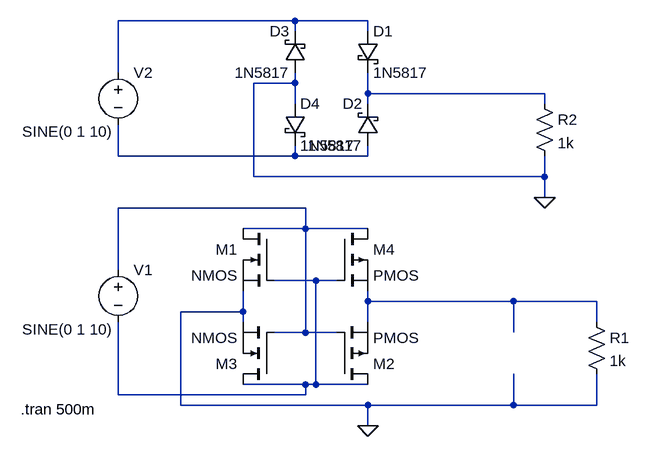
[diagram p0: schematic Gleichrichter.asc]
Gleichrichter.asc, the LTspice schematic file:
Version 4
SHEET 1 1032 680
WIRE 16 -432 -256 -432
WIRE 128 -432 16 -432
WIRE 16 -416 16 -432
WIRE 128 -416 128 -432
WIRE -256 -352 -256 -432
WIRE 16 -336 16 -352
WIRE 16 -336 -48 -336
WIRE 128 -320 128 -352
WIRE 400 -320 128 -320
WIRE 16 -304 16 -336
WIRE 128 -304 128 -320
WIRE 400 -304 400 -320
WIRE -256 -224 -256 -272
WIRE 16 -224 16 -240
WIRE 16 -224 -256 -224
WIRE 128 -224 128 -240
WIRE 128 -224 16 -224
WIRE -48 -192 -48 -336
WIRE 400 -192 400 -224
WIRE 400 -192 -48 -192
WIRE 400 -160 400 -192
WIRE 32 -144 -256 -144
WIRE 32 -112 32 -144
WIRE 32 -112 -64 -112
WIRE 128 -112 32 -112
WIRE -256 -48 -256 -144
WIRE 48 -32 -16 -32
WIRE 80 -32 48 -32
WIRE 128 0 128 -16
WIRE 352 0 128 0
WIRE 480 0 352 0
WIRE -64 16 -64 -16
WIRE -64 16 -160 16
WIRE -64 32 -64 16
WIRE 128 32 128 0
WIRE 480 32 480 0
WIRE 32 48 32 -112
WIRE 32 48 -16 48
WIRE 80 48 32 48
WIRE 352 48 352 0
WIRE 32 128 -64 128
WIRE 48 128 48 -32
WIRE 48 128 32 128
WIRE 128 128 48 128
WIRE -256 144 -256 32
WIRE 32 144 32 128
WIRE 32 144 -256 144
WIRE -160 160 -160 16
WIRE 128 160 -160 160
WIRE 352 160 352 112
WIRE 352 160 128 160
WIRE 480 160 480 112
WIRE 480 160 352 160
WIRE 128 192 128 160
FLAG 128 192 0
FLAG 400 -160 0
SYMBOL nmos -16 -112 M0
SYMATTR InstName M1
SYMBOL pmos 80 128 M180
SYMATTR InstName M2
SYMBOL voltage -256 -64 R0
WINDOW 3 -148 107 Left 2
WINDOW 123 -148 135 Left 2
WINDOW 39 0 0 Left 2
SYMATTR InstName V1
SYMATTR Value SINE(0 1 10)
SYMBOL nmos -16 128 R180
SYMATTR InstName M3
SYMBOL pmos 80 -112 R0
SYMATTR InstName M4
SYMBOL res 464 16 R0
SYMATTR InstName R1
SYMATTR Value 1k
SYMBOL voltage -256 -368 R0
WINDOW 3 -148 107 Left 2
WINDOW 123 -148 135 Left 2
WINDOW 39 0 0 Left 2
SYMATTR InstName V2
SYMATTR Value SINE(0 1 10)
SYMBOL res 384 -320 R0
SYMATTR InstName R2
SYMATTR Value 1k
SYMBOL schottky 112 -416 R0
SYMATTR InstName D1
SYMATTR Value 1N5817
SYMATTR Description Diode
SYMATTR Type diode
SYMBOL schottky 144 -240 R180
WINDOW 0 24 64 Left 2
WINDOW 3 24 0 Left 2
SYMATTR InstName D2
SYMATTR Value 1N5817
SYMATTR Description Diode
SYMATTR Type diode
SYMBOL schottky 32 -352 R180
WINDOW 0 24 64 Left 2
WINDOW 3 24 0 Left 2
SYMATTR InstName D3
SYMATTR Value 1N5817
SYMATTR Description Diode
SYMATTR Type diode
SYMBOL schottky 0 -304 R0
SYMATTR InstName D4
SYMATTR Value 1N5817
SYMATTR Description Diode
SYMATTR Type diode
TEXT -406 166 Left 2 !.tran 500m

The netlist it stands for:
* Gleichrichter.asc
M1 N004 N005 0 0 NMOS
M2 N005 N004 N006 N006 PMOS
V1 N004 N005 SINE(0 1 10)
M3 N005 N004 0 0 NMOS
M4 N004 N005 N006 N006 PMOS
R1 N006 0 1k
V2 N001 N003 SINE(0 1 10)
R2 N002 0 1k
D1 N001 N002 1N5817
D2 N003 N002 1N5817
D3 0 N001 1N5817
D4 0 N003 1N5817
.model D D
.lib standard.dio
.model NMOS NMOS
.model PMOS PMOS
.lib standard.mos
.tran 500m
.backanno
.end